# Altium schematic sheet ADCS.SchDoc
size A
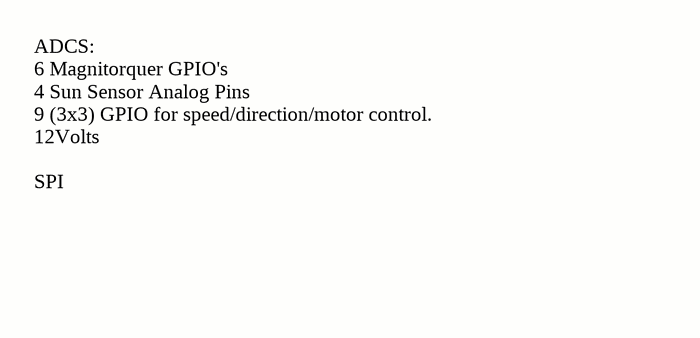
[diagram p0: ADCS.SchDoc]

## Notes on the sheet
- ADCS:
  6 Magnitorquer GPIO's
  4 Sun Sensor Analog Pins
  9 (3x3) GPIO for speed/direction/motor control.
  12Volts
  SPI